# EAGLE design fakealarm_smd (EAGLE 7.1.0)
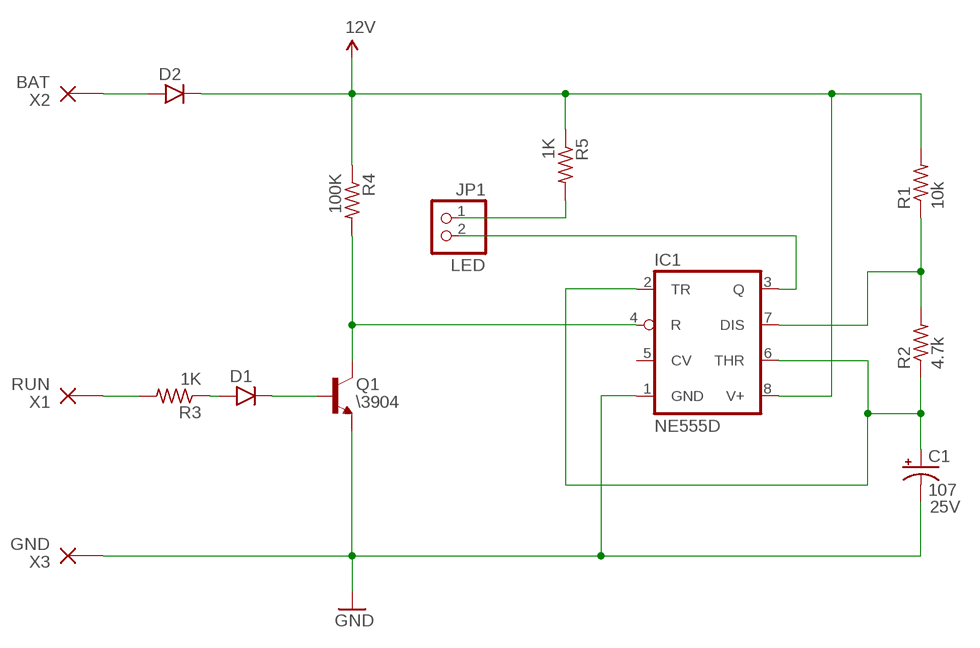
[diagram p0: schematic, sheet 1]

## Parts
C1  107  CPOL-USC  [PANASONIC_C]
D1  DIODE_SOD123FL  [SOD123FL]
D2  DIODE_SOD123FL  [SOD123FL]
IC1  NE555D  [SO08]
JP1  LED  PINHD-1X02_2.54-S  [1X02-S]
Q1  \3904  2N3904SOT23  [SOT-23]
R1  10k  R-US_R0603  [R0603]
R2  4.7k  R-US_R0603  [R0603]
R3  1K  R-US_R0603  [R0603]
R4  100K  R-US_R0603  [R0603]
R5  1K  R-US_R0603  [R0603]
X1  RUN  WIREPAD_14GA  [PAD_14GA]
X2  BAT  WIREPAD_14GA  [PAD_14GA]
X3  GND  WIREPAD_14GA  [PAD_14GA]

## Nets
12V: D2.C IC1.8(V+) R1.2 R4.1 R5.1
GND: C1.- IC1.1(GND) Q1.2(E) X3.P$1(P)
N$1: D1.A R3.1
N$2: D1.C Q1.3(B)
N$3: IC1.7(DIS) R1.1 R2.2
N$4: C1.+ IC1.2(TR) IC1.6(THR) R2.1
N$5: R3.2 X1.P$1(P)
N$6: D2.A X2.P$1(P)
N$9: JP1.1 R5.2
N$10: IC1.3(Q) JP1.2
N$11: IC1.4(R) Q1.1(C) R4.2
Unconnected: IC1.5(CV)

## Library data of the parts
C1 = rcl:CPOL-US: POLARIZED CAPACITOR, American symbol; VOLTAGE: 25V
D1 D2 = bt_diode:DIODE: Diode Collection of generic diodes in various packages
IC1 = linear:*555: TIMER
JP1 = pinhead-2:PINHD-1X02: PIN HEADER
Q1 = bt_transistor:2N3904: NPN Transistor Small signal NPN Bipolar Junction Transistor (BJT). Use this device to represent any of a number of such transistors with similar package and pinout: 2N4401, 2N3904, 2N2222, etc.
R1-R5 = rcl:R-US_: RESISTOR, American symbol
X1-X3 = bt_electromech:WIREPAD: PIN PAD (PINPAD) Generic pin pad connector

## Board
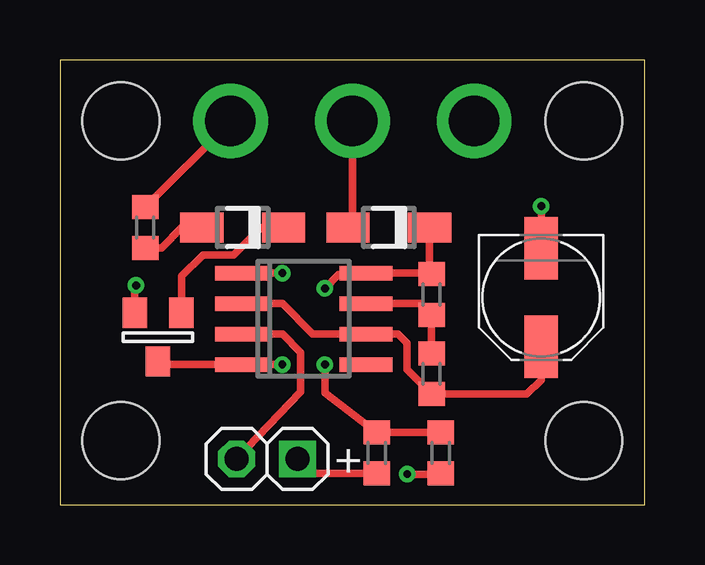
[diagram p1: board, top side]
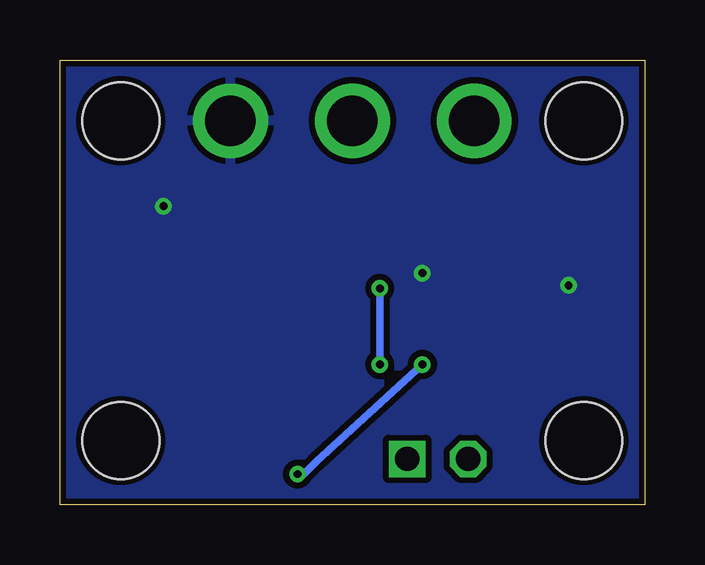
[diagram p2: board, bottom side, seen from below]

Size 24.38 x 18.54 mm. Coordinates in mm from the lower left corner, seen from the top.
Outline: 0,0 24.38,0 24.38,18.54 0,18.54 0,0
Copper layers (1*16): Top 0.0356mm / dielectric 1.5011mm / Bottom 0.0356mm
Design rules "LaenPCBOrder": minimum track width 6mil, minimum drill 13mil, track to track 10mil, track to pad 10mil, pad to pad 10mil, via to via 10mil, smd to smd 8mil, copper to edge 10mil, drill to drill 10mil, minimum pad ring 7mil, minimum via ring 7mil, stop-mask expansion 3mil, vias tented up to drill 20mil, thermal gap 10mil
Holes 3.2 mm at 2.54,2.67 21.84,2.67 21.84,16 2.54,16

### Footprints (pad centres in the part's own frame; a part is rotated, then mirrored left to right if it is on the bottom)
PANASONIC_C = smd 2.6 x 1.4: + 2.05,0; - -2.05,0
SOD123FL = smd 1.8 x 1.25: A 1.7,0; C -1.7,0
SO08 = smd 0.6 x 2.2: 1 -1.905,-2.6; 2 -0.635,-2.6; 3 0.635,-2.6; 4 1.905,-2.6; 5 1.905,2.6; 6 0.635,2.6; 7 -0.635,2.6; 8 -1.905,2.6
1X02-S = drill 1.016 square: 1 -1.27,0 | drill 1.016 octagon: 2 1.27,0
SOT-23 = smd 1.016 x 1.27: 1 0.025,-1.016; 2 -0.94,1.016; 3 0.991,1.016
R0603 = smd 1 x 1.1: 1 -0.85,0; 2 0.85,0
PAD_14GA = drill 2.1: P$1 0,0

### Placement (x,y rotation side)
C1  20.07,8.64 270 top
D1  7.62,11.56 180 top
D2  13.72,11.56 180 top
IC1  10.16,7.75 270 top
JP1  8.64,1.91 180 top
Q1  4.06,6.99 0 top
R1  15.49,8.76 90 top
R2  15.49,5.46 90 top
R3  3.56,11.56 90 top
R4  15.88,2.16 270 top
R5  13.21,2.16 270 top
X1  7.11,16 270 top
X2  12.19,16 270 top
X3  17.27,16 270 top

### Tracks (layer width: path | path; a pad name or v marks a point on that pad's centre or on a via)
12V  (via drill 0.33)
  Top 0.305: R4.1 R5.1 11.05,4.66 v11.05,5.84 | D2.C 15.42,9.69 R1.2 15.46,9.65 IC1.8 12.76,9.59 11.62,9.59 v11.05,9.02
  Bottom 0.305: v11.05,9.02 v11.05,5.84
GND  (via drill 0.33)
  Top 0.305: Q1.2 3.12,9.09 v3.17,9.14 | IC1.1 v9.27,9.65 | C1.- v20.07,12.45
  pour Bottom: 0,18.54 24.38,18.54 24.38,0 0,0
N$1
  Top 0.305: R3.1 4.23,10.71 5.08,11.56 D1.A
N$2
  Top 0.305: D1.C 8.38,11.56 7.24,10.41 5.97,10.41 5.08,9.53 5.08,8.03 Q1.3
N$3
  Top 0.305: IC1.7 15.03,8.38 R1.1 R2.2
N$4
  Top 0.305: C1.+ 20.07,5.21 19.47,4.61 R2.1 14.48,5.63 14.48,6.73 14.1,7.11 IC1.6 10.54,7.11 9.27,8.38 IC1.2
N$5
  Top 0.305: X1.P$1 7.02,15.88 R3.2
N$6
  Top 0.305: X2.P$1 12.19,11.73 D2.A
N$9
  Top 0.305: R5.2 10.5,1.31 JP1.1
N$10
  Top 0.305: IC1.3 9.27,7.11 10.03,6.35 10.03,4.7 JP1.2
N$11  (via drill 0.33)
  Top 0.305: Q1.1 4.22,5.84 IC1.4 v9.27,5.84 | v14.48,1.27 15.41,1.27 R4.2
  Bottom 0.305: v9.27,5.84 13.72,1.78 14.22,1.27 v14.48,1.27

### Text on the board
tPlace: +